# EAGLE design control (EAGLE 5.01)
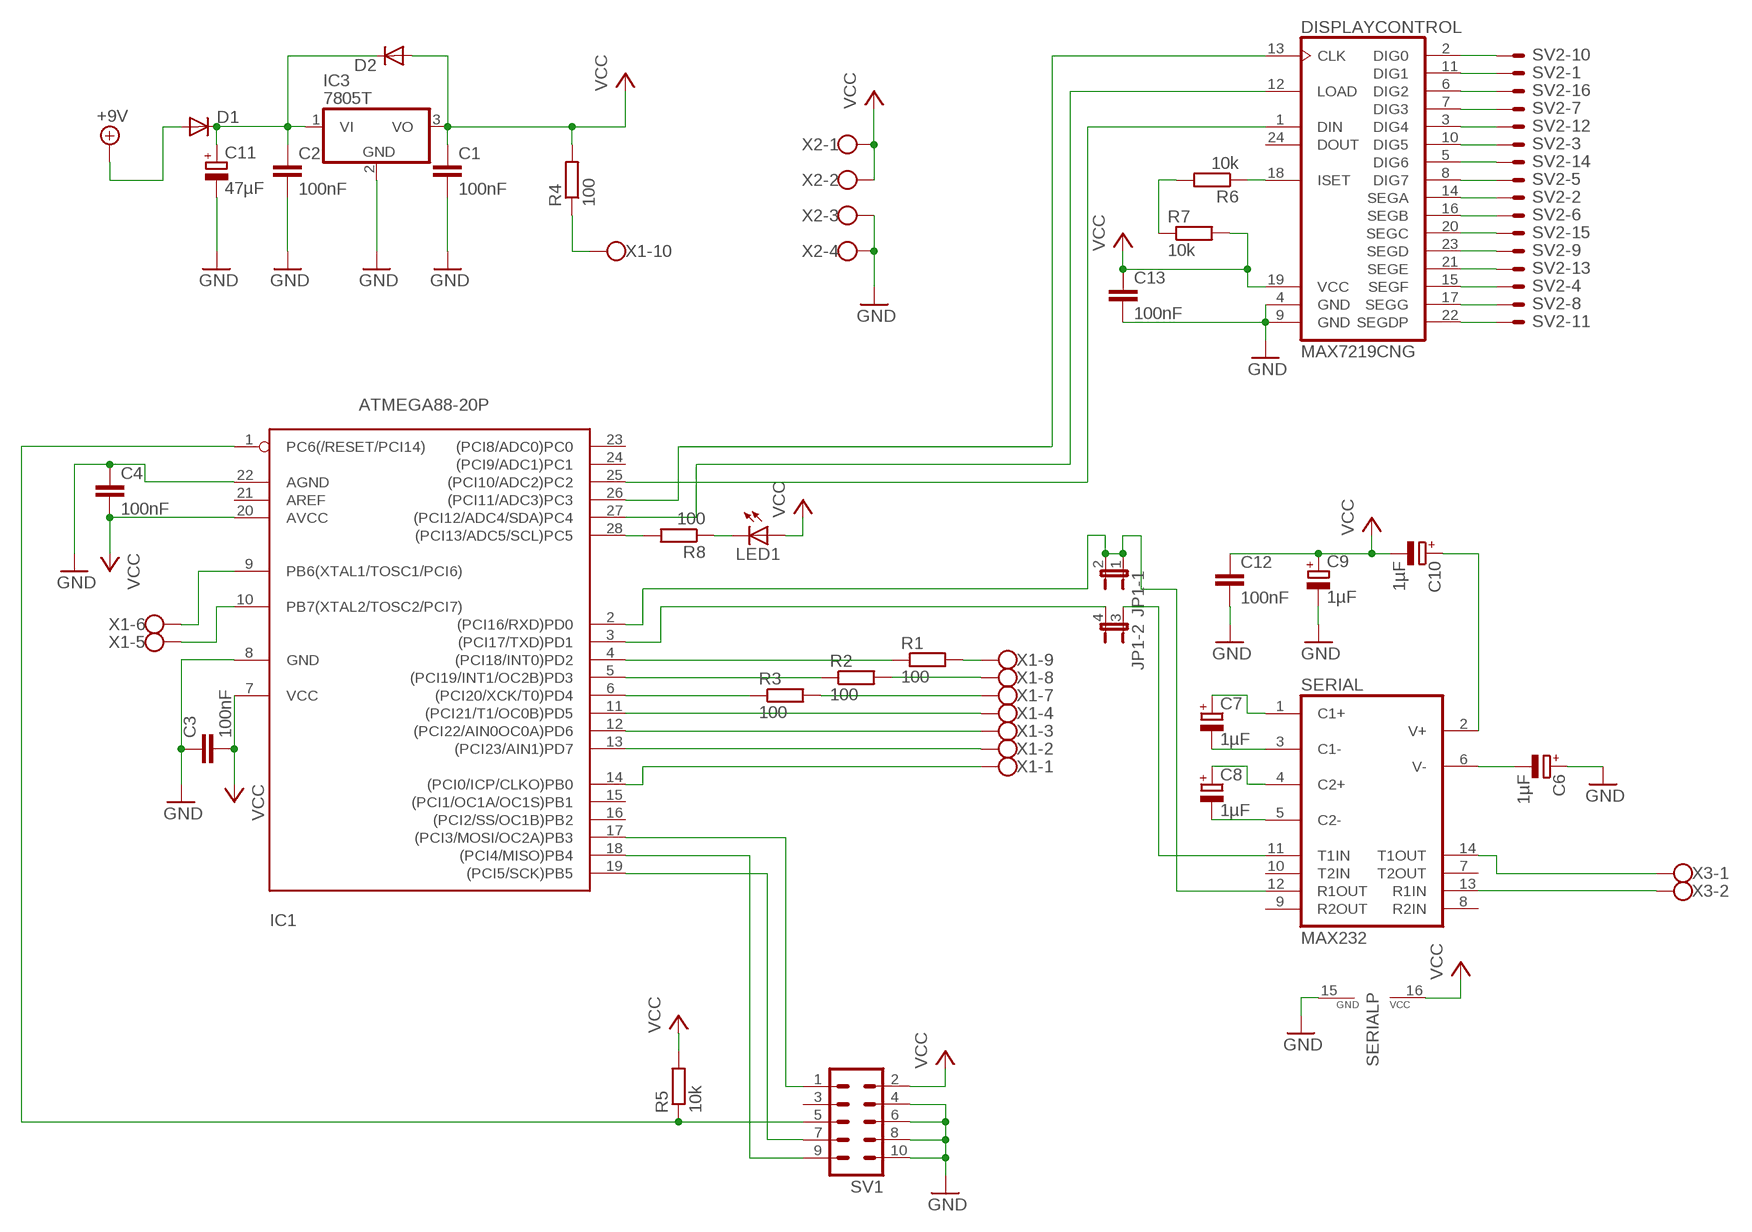
[diagram p0: schematic, sheet 1]

## Parts
C1  100nF  C-EU025-024X044  [C025-024X044]
C2  100nF  C-EU025-024X044  [C025-024X044]
C3  100nF  C-EU025-024X044  [C025-024X044]
C4  100nF  C-EU025-024X044  [C025-024X044]
C6  1µF  CPOL-EUE22-6AXIAL  [E22-6]
C7  1µF  CPOL-EUE22-6AXIAL  [E22-6]
C8  1µF  CPOL-EUE22-6AXIAL  [E22-6]
C9  1µF  CPOL-EUE22-6AXIAL  [E22-6]
C10  1µF  CPOL-EUE22-6AXIAL  [E22-6]
C11  47µF  CPOL-EUE2,5-6E  [E2,5-6E]
C12  100nF  C-EU025-024X044  [C025-024X044]
C13  100nF  C-EU025-024X044  [C025-024X044]
D1  DIODE-C1702-05  [C1702-05]
D2  DIODE-C1702-05  [C1702-05]
DISPLAYCONTROL  MAX7219CNG  [DIL24-3]
IC1  ATMEGA88-20P  [DIL28-3]
IC3  7805T  [TO220H]
JP1  JP2QE  [JP2Q]
LED1  LED3MM  [LED3MM]
R1  100  R-EU_0204/5  [0204/5]
R2  100  R-EU_0204/5  [0204/5]
R3  100  R-EU_0204/5  [0204/5]
R4  100  R-EU_0204/5  [0204/5]
R5  10k  R-EU_0204/5  [0204/5]
R6  10k  R-EU_0309/V  [0309V]
R7  10k  R-EU_0309/V  [0309V]
R8  100  R-EU_0204/5  [0204/5]
SERIAL  MAX232  [DIL16]
SV1  ML10  [ML10]
SV2  ML16E  [ML16]
X1  W237-10P  [W237-10P]
X2  W237-04P  [W237-4P]
X3  W237-02P  [W237-132]

## Nets
+9V: D1.A
CLOCK: DISPLAYCONTROL.13(CLK) IC1.26((PCI11/ADC3)PC3)
DIN: DISPLAYCONTROL.1(DIN) IC1.25((PCI10/ADC2)PC2)
GND: C1.2 C2.2 C3.1 C4.1 C6.+ C9.- C11.- C12.2 C13.2 DISPLAYCONTROL.4(GND) DISPLAYCONTROL.9(GND) IC1.8(GND) IC1.22(AGND) IC3.2(GND) SERIAL.15(GND) SV1.4 SV1.6 SV1.8 SV1.10 X2.3 X2.4
ISP_MISO: IC1.18((PCI4/MISO)PB4) SV1.9
ISP_MOSI: IC1.17((PCI3/MOSI/OC2A)PB3) SV1.1
ISP_RESET: IC1.1(PC6(/RESET/PCI14)) R5.1 SV1.5
ISP_SCK: IC1.19((PCI5/SCK)PB5) SV1.7
LOAD: DISPLAYCONTROL.12(LOAD) IC1.27((PCI12/ADC4/SDA)PC4)
N$1: IC1.3((PCI17/TXD)PD1) JP1.4
N$3: IC1.4((PCI18/INT0)PD2) R1.1
N$4: C7.+ SERIAL.1(C1+)
N$6: C7.- SERIAL.3(C1-)
N$7: IC1.5((PCI19/INT1/OC2B)PD3) R2.1
N$8: DISPLAYCONTROL.18(ISET) R6.1
N$9: C8.+ SERIAL.4(C2+)
N$10: C8.- SERIAL.5(C2-)
N$11: C10.+ SERIAL.2(V+)
N$12: IC1.6((PCI20/XCK/T0)PD4) R3.1
N$13: R1.2 X1.9
N$14: R2.2 X1.8
N$15: R3.2 X1.7
N$16: IC1.14((PCI0/ICP/CLKO)PB0) X1.1
N$17: SERIAL.13(R1IN) X3.2
N$18: C2.1 C11.+ D1.C D2.C IC3.1(VI)
N$19: IC1.10(PB7(XTAL2/TOSC2/PCI7)) X1.5
N$20: IC1.9(PB6(XTAL1/TOSC1/PCI6)) X1.6
N$21: DISPLAYCONTROL.20(SEGC) SV2.15
N$22: IC1.12((PCI22/AIN0OC0A)PD6) X1.3
N$23: R4.1 X1.10
N$24: SERIAL.14(T1OUT) X3.1
N$25: DISPLAYCONTROL.11(DIG1) SV2.1
N$26: DISPLAYCONTROL.6(DIG2) SV2.16
N$27: DISPLAYCONTROL.7(DIG3) SV2.7
N$28: DISPLAYCONTROL.21(SEGE) SV2.13
N$29: DISPLAYCONTROL.10(DIG5) SV2.3
N$30: DISPLAYCONTROL.5(DIG6) SV2.14
N$31: DISPLAYCONTROL.8(DIG7) SV2.5
N$32: DISPLAYCONTROL.14(SEGA) SV2.2
N$33: DISPLAYCONTROL.16(SEGB) SV2.6
N$34: DISPLAYCONTROL.3(DIG4) SV2.12
N$35: DISPLAYCONTROL.23(SEGD) SV2.9
N$36: DISPLAYCONTROL.22(SEGDP) SV2.11
N$37: DISPLAYCONTROL.17(SEGG) SV2.8
N$38: DISPLAYCONTROL.2(DIG0) SV2.10
N$40: C6.- SERIAL.6(V-)
N$41: R6.2 R7.1
N$42: IC1.13((PCI23/AIN1)PD7) X1.2
N$43: IC1.11((PCI21/T1/OC0B)PD5) X1.4
N$48: IC1.28((PCI13/ADC5/SCL)PC5) R8.2
N$58: LED1.K(C) R8.1
N$59: IC1.2((PCI16/RXD)PD0) JP1.1 JP1.2 SERIAL.12(R1OUT)
N$60: JP1.3 SERIAL.11(T1IN)
SEGF: DISPLAYCONTROL.15(SEGF) SV2.4
VCC: C1.1 C3.2 C4.2 C9.+ C10.- C12.1 C13.1 D2.A DISPLAYCONTROL.19(VCC) IC1.7(VCC) IC1.20(AVCC) IC3.3(VO) LED1.A R4.2 R5.2 R7.2 SERIAL.16(VCC) SV1.2 X2.1 X2.2
Unconnected: DISPLAYCONTROL.24(DOUT) IC1.15((PCI1/OC1A/OC1S)PB1) IC1.16((PCI2/SS/OC1B)PB2) IC1.21(AREF) IC1.23((PCI8/ADC0)PC0) IC1.24((PCI9/ADC1)PC1) SERIAL.7(T2OUT) SERIAL.8(R2IN) SERIAL.9(R2OUT) SERIAL.10(T2IN) SV1.3

## Library data of the parts
C1-C4 C12 C13 = rcl:C-EU: CAPACITOR, European symbol
C6-C11 = rcl:CPOL-EU: POLARIZED CAPACITOR, European symbol
D1 D2 = diode:DIODE-: DIODE
DISPLAYCONTROL = maxim:MAX7219CNG: LED DISPLAY DRIVER
IC1 = avr:ATMEGA88*P: MICROCONTROLLER 8 kBytes FLASH 1 kBytes SRAM 512 Bytes EEPROM USART 8-channel 10 bit ADC
IC3 = linear:78*: Positive VOLTAGE REGULATOR Source: http://cache.national.com/ds/LM/LM78L05.pdf http://www.fairchildsemi.com/ds/LM/LM7805.pdf
JP1 = jumper:JP2QE: JUMPER
LED1 = led:LED: LED OSRAM: - CHIPLED LG R971, LG N971, LY N971, LG Q971, LY Q971, LO R971, LY R971 LH N974, LH R974 LS Q976, LO Q976, LY Q976 LO Q996 - Hyper CHIPLED LW Q18S LB Q993, LB Q99A, LB R99A - SideLED LS A670, LO A670, LY A670, LG A670, LP A670 LB A673, LV A673, LT A673, LW A673 LH A674 LY A675 LS A676, LA A676, LO A676, LY A676, LW A676 LS A679, LY A679, LG A679 - Hyper Micro SIDELED® LS Y876, LA Y876, LO Y876, LY Y876 LT Y87S - SmartLED LW L88C, LW L88S LB L89C, LB L89S, LG L890 LS L89K, LO L89K, LY L89K LS L896, LA L896, LO L896, LY L896 - TOPLED LS T670, LO T670, LY T670, LG T670, LP T670 LSG T670, LSP T670, LSY T670, LOP T670, LYG T670 LG T671, LOG T671, LSG T671 LB T673, LV T673, LT T673, LW T673 LH T674 LS T676, LA T676, LO T676, LY T676, LB T676, LH T676, LSB T676, LW T676 LB T67C, LV T67C, LT T67C, LS T67K, LO T67K, LY T67K, LW E67C LS E67B, LA E67B, LO E67B, LY E67B, LB E67C, LV E67C, LT E67C LW T67C LS T679, LY T679, LG T679 LS T770, LO T770, LY T770, LG T770, LP T770 LB T773, LV T773, LT T773, LW T773 LH T774 LS E675, LA E675, LY E675, LS T675 LS T776, LA T776, LO T776, LY T776, LB T776 LHGB T686 LT T68C, LB T68C - Hyper Mini TOPLED® LB M676 - Mini TOPLED Santana® LG M470 LS M47K, LO M47K, LY M47K Source: http://www.osram.convergy.de - LUMILED® LXK2-PW12-R00, LXK2-PW12-S00, LXK2-PW14-U00, LXK2-PW14-V00 LXK2-PM12-R00, LXK2-PM12-S00, LXK2-PM14-U00 LXK2-PE12-Q00, LXK2-PE12-R00, LXK2-PE12-S00, LXK2-PE14-T00, LXK2-PE14-U00 LXK2-PB12-K00, LXK2-PB12-L00, LXK2-PB12-M00, LXK2-PB14-N00, LXK2-PB14-P00, LXK2-PB14-Q00 LXK2-PR12-L00, LXK2-PR12-M00, LXK2-PR14-Q00, LXK2-PR14-R00 LXK2-PD12-Q00, LXK2-PD12-R00, LXK2-PD12-S00 LXK2-PH12-R00, LXK2-PH12-S00 LXK2-PL12-P00, LXK2-PL12-Q00, LXK2-PL12-R00 Source: www.luxeon.com
R1-R5 R8 = resistor:R-EU_: RESISTOR, European symbol
R6 R7 = rcl:R-EU_: RESISTOR, European symbol
SERIAL = maxim:MAX232: RS232 TRANSEIVER
SV1 = con-harting-ml:ML10: HARTING
SV2 = con-harting-ml:ML16?E: HARTING
X1 = con-wago-508:W237-10P: WAGO SREW CLAMP
X2 = con-wago-508:W237-04P: WAGO SREW CLAMP
X3 = con-wago-508:W237-02P: WAGO SREW CLAMP

## Board
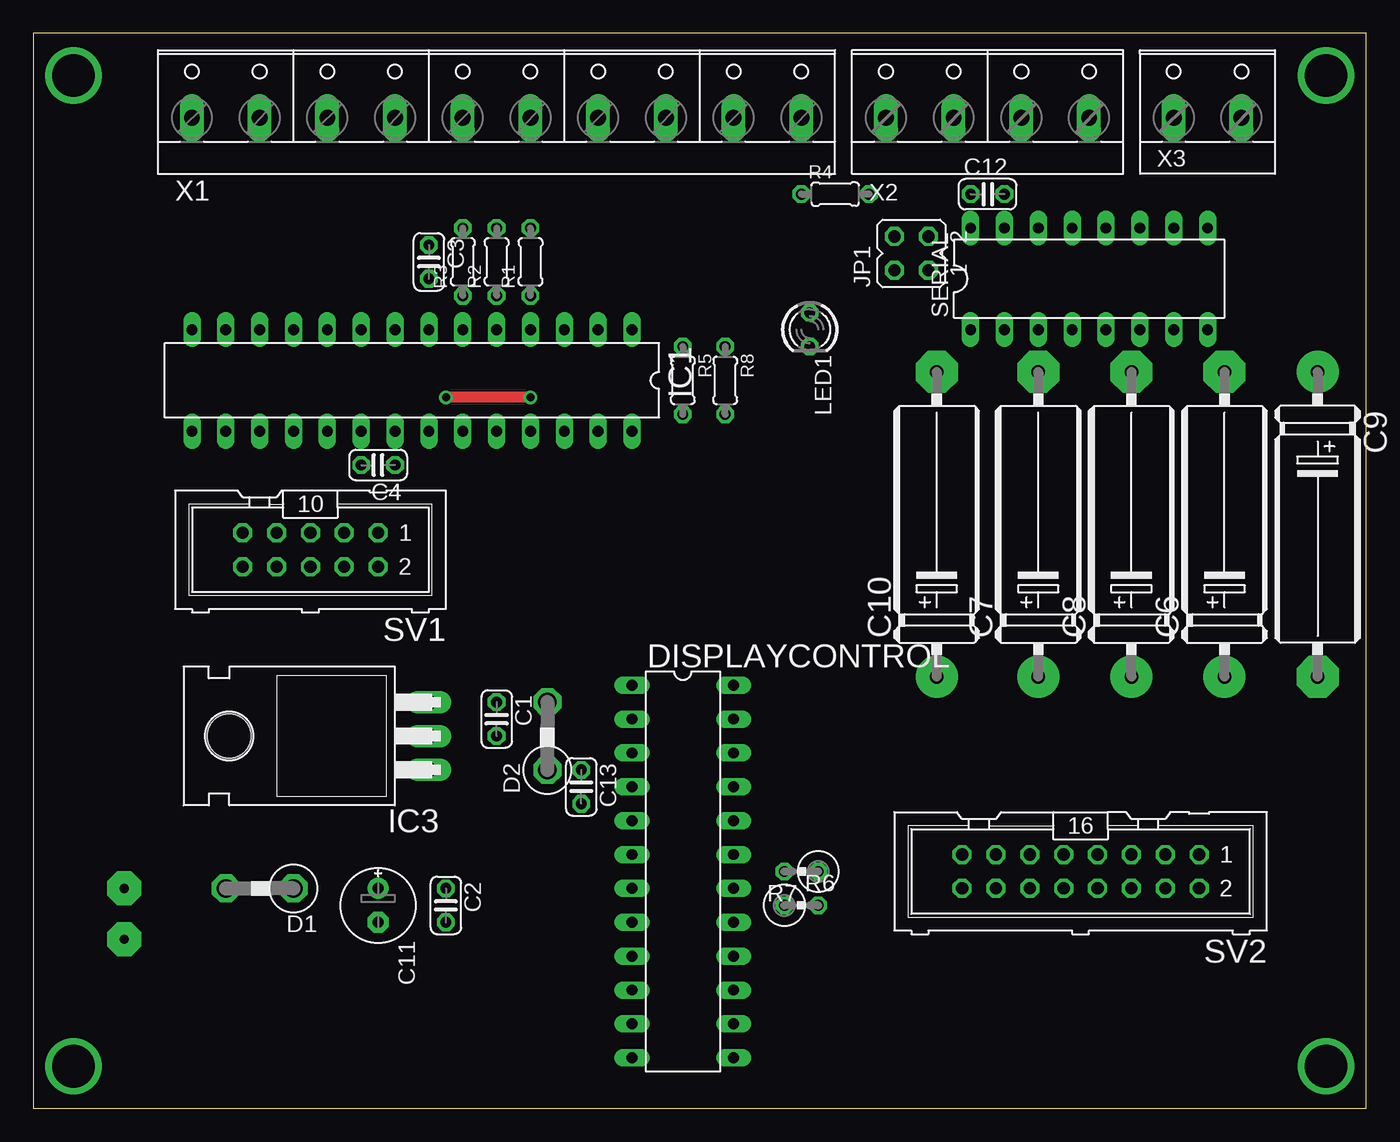
[diagram p1: board, top side]
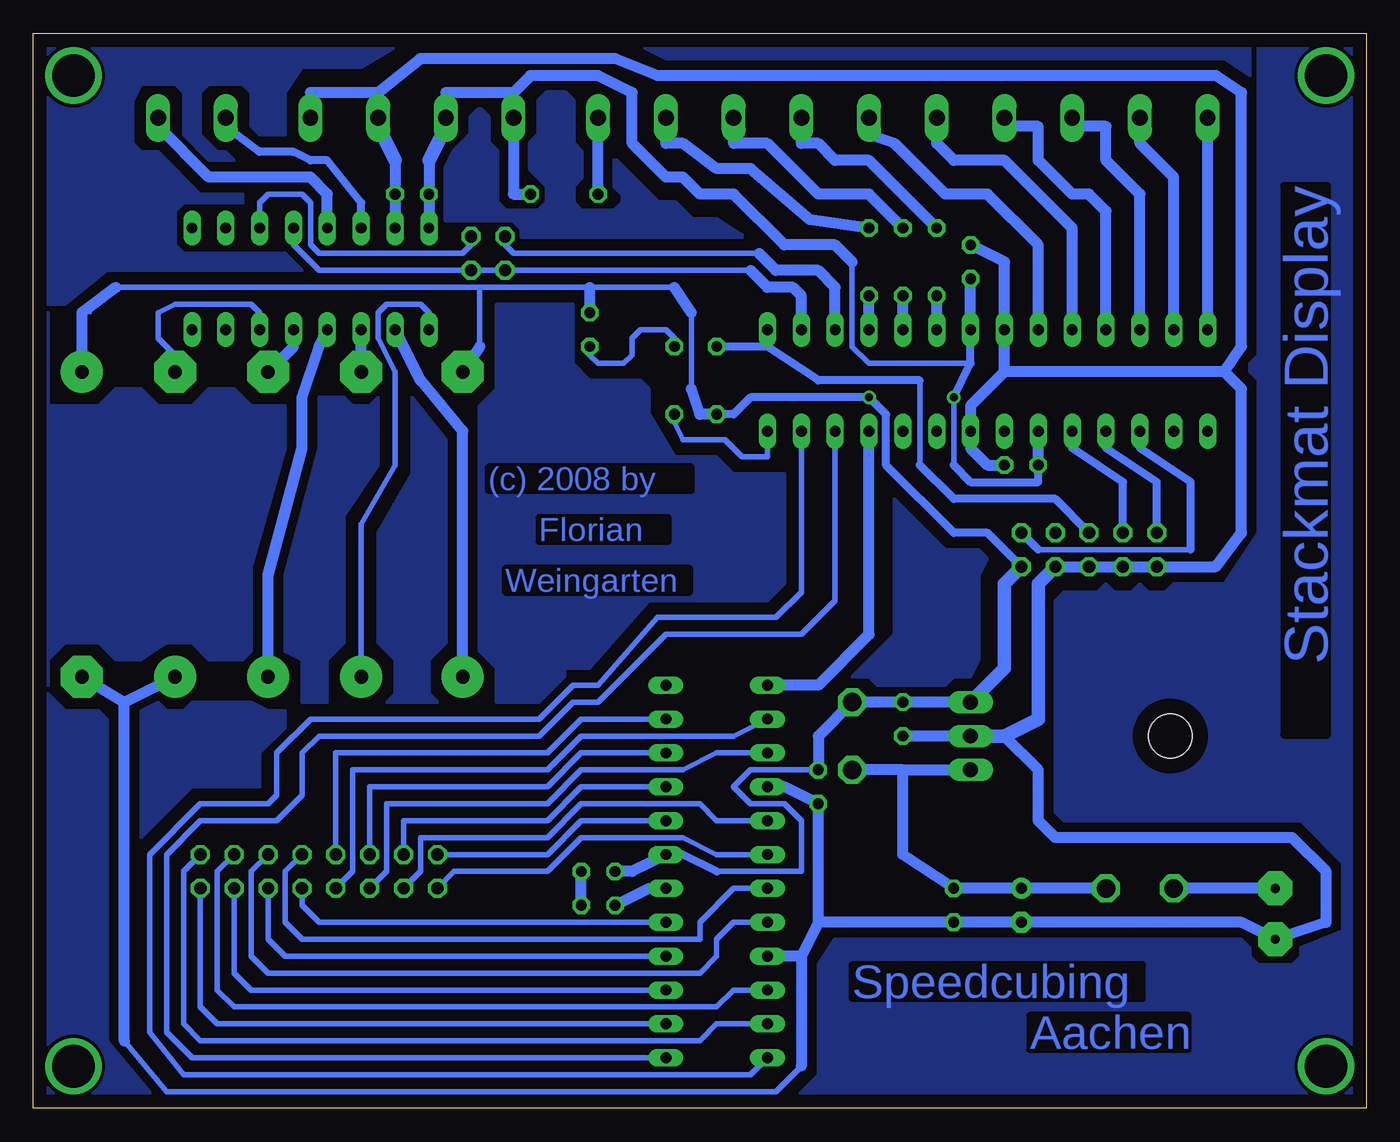
[diagram p2: board, bottom side, seen from below]

Size 100 x 80.64 mm. Coordinates in mm from the lower left corner, seen from the top.
Outline: 0,0 100,0 100,80.64 0,80.64 0,0
Copper layers (1*16): Top 0.035mm / dielectric 1.5mm / Bottom 0.035mm
Design rules "default": minimum track width 10mil, minimum drill 24mil, track to track 8mil, track to pad 8mil, pad to pad 8mil, via to via 8mil, smd to smd 8mil, copper to edge 40mil, drill to drill 8mil, minimum pad ring 10mil, minimum via ring 8mil, stop-mask expansion 4mil, vias tented up to drill 0mil, thermal gap 10mil

### Footprints (pad centres in the part's own frame; a part is rotated, then mirrored left to right if it is on the bottom)
C025-024X044 = drill 0.813 octagon: 1 -1.27,0; 2 1.27,0
E22-6 = drill 1.016 pad 3.15 round: + -11.43,0 | drill 1.016 pad 3.15 octagon: - 11.43,0
E2,5-6E = drill 0.813 pad 1.575 round: + -1.27,0 | drill 0.813 pad 1.575 octagon: - 1.27,0
C1702-05 = drill 1.397 octagon: A 2.54,0; C -2.54,0
DIL24-3 = drill 0.813 long: 1 -13.97,-3.81; 2 -11.43,-3.81; 3 -8.89,-3.81; 4 -6.35,-3.81; 5 -3.81,-3.81; 6 -1.27,-3.81; 7 1.27,-3.81; 8 3.81,-3.81; 9 6.35,-3.81; 10 8.89,-3.81; 11 11.43,-3.81; 12 13.97,-3.81; 13 13.97,3.81; 14 11.43,3.81; 15 8.89,3.81; 16 6.35,3.81; 17 3.81,3.81; 18 1.27,3.81; 19 -1.27,3.81; 20 -3.81,3.81; 21 -6.35,3.81; 22 -8.89,3.81; 23 -11.43,3.81; 24 -13.97,3.81
DIL28-3 = drill 0.813 long: 1 -16.51,-3.81; 2 -13.97,-3.81; 3 -11.43,-3.81; 4 -8.89,-3.81; 5 -6.35,-3.81; 6 -3.81,-3.81; 7 -1.27,-3.81; 8 1.27,-3.81; 9 3.81,-3.81; 10 6.35,-3.81; 11 8.89,-3.81; 12 11.43,-3.81; 13 13.97,-3.81; 14 16.51,-3.81; 15 16.51,3.81; 16 13.97,3.81; 17 11.43,3.81; 18 8.89,3.81; 19 6.35,3.81; 20 3.81,3.81; 21 1.27,3.81; 22 -1.27,3.81; 23 -3.81,3.81; 24 -6.35,3.81; 25 -8.89,3.81; 26 -11.43,3.81; 27 -13.97,3.81; 28 -16.51,3.81
TO220H = drill 1.118 long: 1 -2.54,-10.16; 2 0,-10.16; 3 2.54,-10.16 | hole 3.302: 0,4.826
JP2Q = drill 0.914 octagon: 1 -1.27,-1.27; 2 -1.27,1.27; 3 1.27,-1.27; 4 1.27,1.27
LED3MM = drill 0.813 octagon: A -1.27,0; K 1.27,0
0204/5 = drill 0.813 octagon: 1 -2.54,0; 2 2.54,0
0309V = drill 0.813 octagon: 1 -1.27,0; 2 1.27,0
DIL16 = drill 0.813 long: 1 -8.89,-3.81; 2 -6.35,-3.81; 3 -3.81,-3.81; 4 -1.27,-3.81; 5 1.27,-3.81; 6 3.81,-3.81; 7 6.35,-3.81; 8 8.89,-3.81; 9 8.89,3.81; 10 6.35,3.81; 11 3.81,3.81; 12 1.27,3.81; 13 -1.27,3.81; 14 -3.81,3.81; 15 -6.35,3.81; 16 -8.89,3.81
ML10 = drill 0.914 octagon: 1 -5.08,-1.27; 2 -5.08,1.27; 3 -2.54,-1.27; 4 -2.54,1.27; 5 0,-1.27; 6 0,1.27; 7 2.54,-1.27; 8 2.54,1.27; 9 5.08,-1.27; 10 5.08,1.27
ML16 = drill 0.914 octagon: 1 -8.89,-1.27; 2 -8.89,1.27; 3 -6.35,-1.27; 4 -6.35,1.27; 5 -3.81,-1.27; 6 -3.81,1.27; 7 -1.27,-1.27; 8 -1.27,1.27; 9 1.27,-1.27; 10 1.27,1.27; 11 3.81,-1.27; 12 3.81,1.27; 13 6.35,-1.27; 14 6.35,1.27; 15 8.89,-1.27; 16 8.89,1.27
W237-10P = drill 1.194 long: 1 -22.86,-0.635; 2 -17.78,-0.635; 3 -12.7,-0.635; 4 -7.62,-0.635; 5 -2.54,-0.635; 6 2.54,-0.635; 7 7.62,-0.635; 8 12.7,-0.635; 9 17.78,-0.635; 10 22.86,-0.635
W237-4P = drill 1.194 long: 1 -7.62,-0.635; 2 -2.54,-0.635; 3 2.54,-0.635; 4 7.62,-0.635
W237-132 = drill 1.194 long: 1 -2.54,-0.635; 2 2.54,-0.635

### Placement (x,y rotation side)
C1  34.76,29.21 270 top
C2  30.95,15.24 270 top
C3  29.68,63.49 270 top
C4  25.87,48.26 180 top
C6  89.37,43.81 90 top
C7  75.4,43.81 90 top
C8  82.38,43.81 90 top
C9  96.35,43.81 270 top
C10  67.78,43.81 90 top
C11  25.87,15.24 270 top
C12  71.59,68.58 0 top
C13  41.11,24.12 270 top
D1  16.98,16.5 180 top
D2  38.57,27.94 90 top
DISPLAYCONTROL  48.73,17.78 270 top
IC1  28.41,54.61 180 top
IC3  19.52,27.94 90 top
JP1  65.88,64.13 90 top
LED1  58.26,58.41 270 top
R1  37.3,63.49 90 top
R2  34.76,63.49 90 top
R3  32.22,63.49 90 top
R4  60.16,68.58 0 top
R5  48.73,54.61 270 top
R6  57.62,15.24 0 top
R7  57.62,17.78 180 top
R8  51.91,54.61 270 top
SERIAL  79.21,62.23 0 top
SV1  20.79,41.91 180 top
SV2  78.57,17.78 180 top
X1  34.76,74.92 0 top
X2  71.59,74.92 0 top
X3  88.1,74.92 0 top

### Tracks (layer width: path | path; a pad name or v marks a point on that pad's centre or on a via)
+9V  (via drill 0.7 pad 2.54)
  Bottom 0.813: v6.82,16.5 D1.A
CLOCK
  Bottom 0.406: DISPLAYCONTROL.13 88.1,3.8 90,5.71 90,19.05 87.46,21.59 81.75,21.59 79.84,23.49 79.84,26.66 78.57,27.94 62.07,27.94 59.52,30.48 57.62,30.48 52.54,35.55 42.38,35.55 39.84,38.09 IC1.26 39.84,51.43
DIN
  Bottom 0.813: IC1.25 37.3,35.55 41.11,31.75 DISPLAYCONTROL.1
GND  (via drill 0.7 pad 2.54)
  Bottom 0.406: 42.38,3.17 44.29,1.26 90,1.26 93.18,5.08
  Bottom 0.813: 27.14,27.94 24.6,25.39 24.6,21.59 23.33,20.32 5.55,20.32 3.01,17.78 3.01,13.96 v6.82,12.7 9.36,13.96 C11.- C2.2 41.11,13.96 | IC3.2 C1.2 | C3.1 27.14,63.49 IC1.8 27.14,55.24 | C4.1 28.41,48.26 29.68,49.52 IC1.22 29.68,52.7 27.14,55.24 | SV1.4 SV1.6 SV1.8 SV1.10 11.27,40.63 9.36,43.17 9.36,53.97 10.63,55.24 | 74.13,76.2 X2.3 74.13,73.66 | 74.13,76.2 79.21,76.2 X2.4 79.21,73.66 | SERIAL.15 C12.2 72.86,71.11 | 41.11,13.96 42.38,11.43 | 42.38,11.43 DISPLAYCONTROL.9 | DISPLAYCONTROL.4 43.65,24.12 C13.2 41.11,13.96 | 42.38,11.43 42.38,3.17 | 93.18,5.08 93.18,30.48 | 93.18,30.48 C6.+ | 93.18,30.48 C9.- | 10.63,55.24 27.14,55.24 | 10.63,55.24 9.36,57.15 9.36,76.2 11.27,77.47 53.18,77.47 56.35,78.73 70.95,78.73 74.13,76.2
  Bottom 1.016: SV1.4 24.6,39.37 24.6,29.21 27.14,27.94 IC3.2 | 74.13,73.66 72.86,71.11
ISP_MISO
  Bottom 0.61: IC1.18 19.52,49.52 15.71,46.98 SV1.9
ISP_MOSI
  Bottom 0.406: 13.17,41.91 24.6,41.91
  Bottom 0.61: IC1.17 16.98,49.52 13.17,46.98 13.17,41.91 | 24.6,41.91 SV1.1
ISP_RESET
  Bottom 0.406: 33.49,48.26 33.49,54.61
  Bottom 0.61: SV1.5 23.33,45.72 30.95,45.72 33.49,48.26 | 33.49,54.61 41.11,54.61 44.92,57.15 | 44.92,57.15 IC1.1 | 44.92,57.15 R5.1
ISP_SCK
  Bottom 0.61: IC1.19 22.06,49.52 18.25,46.98 SV1.7
LOAD
  Bottom 0.406: IC1.27 42.38,38.73 44.29,36.83 53.18,36.83 57.62,31.75 59.52,31.75 62.07,29.21 79.21,29.21 81.75,26.66 81.75,23.49 82.38,22.86 87.46,22.86 91.27,19.05 91.27,5.71 88.73,2.54 46.19,2.54 DISPLAYCONTROL.12
N$1
  Bottom 0.406: JP1.4 64.61,64.77 63.97,64.13 45.55,64.13
  Bottom 0.813: 45.55,64.13 44.29,62.86 41.11,62.86 39.84,61.59 IC1.3
N$3
  Bottom 0.813: IC1.4 R1.1
N$4
  Bottom 0.406: SERIAL.1 70.32,59.69 70.95,60.32 73.49,60.32 74.13,59.69 74.13,57.78 72.86,55.24 72.86,48.26 75.4,43.81 C7.+
N$5
  pour Bottom (isolate 0.254): -0.17,80.64 8.09,80.64 8.09,56.51 8.72,55.88 8.72,55.24 8.09,54.61 8.09,43.17 10.63,39.37 14.44,39.37 15.08,38.73 16.34,38.73 16.98,39.37 17.61,38.73 18.88,38.73 19.52,39.37 20.15,38.73 22.69,38.73 23.33,38.09 23.33,22.22 22.69,21.59 4.92,21.59 1.74,18.41 1.74,13.33 4.92,12.06 4.92,11.43 5.55,10.79 8.09,10.79 8.72,11.43 8.72,12.06 9.36,12.7 39.84,12.7 41.11,10.79 41.11,2.54 43.02,0.63 -0.17,0.63
N$6
  Bottom 0.813: C7.- SERIAL.3
N$7
  Bottom 0.813: IC1.5 R2.1
N$8
  Bottom 0.813: DISPLAYCONTROL.18 53.81,16.5 R6.1
N$9
  Bottom 0.813: SERIAL.4 78.57,57.15 79.84,53.34 79.84,49.52 82.38,40 C8.+
N$10
  Bottom 0.813: C8.- 80.48,57.15 SERIAL.5
N$11
  Bottom 0.813: SERIAL.2 70.95,54.61 67.78,50.8 C10.+
N$12
  Bottom 0.813: IC1.6 R3.1
N$13
  Bottom 0.813: R1.2 41.75,66.67 46.19,70.48 48.73,70.48 51.27,72.39 52.54,72.39 X1.9 52.54,74.92
N$14
  Bottom 0.813: R2.2 37.3,68.58 41.11,68.58 44.92,72.39 47.46,72.39 X1.8 47.46,74.92
N$15
  Bottom 0.813: R3.2 37.3,71.11 39.84,71.11 41.11,72.39 42.38,72.39 X1.7 42.38,74.92
N$16
  Bottom 0.813: IC1.14 X1.1 11.9,74.92
N$17
  Bottom 0.813: SERIAL.13 77.94,68.58 79.21,69.84 86.83,69.84 90.64,73.66 X3.2 90.64,74.92
N$18
  Bottom 0.813: D1.C C11.+ C2.1 34.76,19.05 34.76,25.39 | 34.76,25.39 IC3.1 | 34.76,25.39 D2.C
N$19
  Bottom 0.813: IC1.10 22.06,66.03 27.14,71.11 30.95,71.11 32.22,72.39 X1.5 32.22,74.92
N$20
  Bottom 0.813: IC1.9 24.6,64.77 28.41,68.58 31.58,68.58 35.4,72.39 37.3,73.02 X1.6 37.3,74.92
N$21
  Bottom 0.406: DISPLAYCONTROL.20 58.89,21.59 61.43,19.05 SV2.15
N$22
  Bottom 0.813: 22.06,74.92 X1.3 22.06,73.66 19.52,73.66 19.52,71.11 16.98,68.58 IC1.12
N$23
  Bottom 0.813: R4.1 X1.10 57.62,74.92
N$24
  Bottom 0.61: 85.56,73.66 83.02,71.75 80.48,71.75 79.21,71.11 77.94,71.11 75.4,67.94 SERIAL.14
  Bottom 1.016: 85.56,73.66 X3.1 85.56,74.92
N$25
  Bottom 0.406: DISPLAYCONTROL.11 48.73,6.34 50,5.08 87.46,5.08 88.73,6.34 88.73,17.78 SV2.1
N$26
  Bottom 0.406: DISPLAYCONTROL.6 48.73,19.05 51.27,20.32 58.89,20.32 61.43,17.78 68.41,17.78 SV2.16
N$27
  Bottom 0.406: DISPLAYCONTROL.7 47.46,16.5 50,13.96 50,12.7 79.84,12.7 81.11,13.96 81.11,17.78 SV2.7
N$28
  Bottom 0.406: DISPLAYCONTROL.21 58.89,24.12 61.43,21.59 72.22,21.59 SV2.13
N$29
  Bottom 0.406: DISPLAYCONTROL.10 47.46,8.88 48.73,7.61 84.92,7.61 86.19,8.88 86.19,17.78 SV2.3
N$30
  Bottom 0.406: DISPLAYCONTROL.5 48.73,21.59 50,22.86 58.89,22.86 61.43,20.32 70.95,20.32 70.95,17.78 SV2.14
N$31
  Bottom 0.406: DISPLAYCONTROL.8 47.46,13.96 48.73,12.7 48.73,11.43 50,10.16 82.38,10.16 83.66,11.43 83.66,17.78 SV2.5
N$32
  Bottom 0.406: DISPLAYCONTROL.14 86.19,6.34 87.46,7.61 SV2.2
N$33
  Bottom 0.406: DISPLAYCONTROL.16 81.11,11.43 82.38,12.7 SV2.6
N$34
  Bottom 0.406: SV2.12 73.49,17.78 73.49,22.86 61.43,22.86 58.89,25.39 51.27,25.39 48.73,26.66 DISPLAYCONTROL.3
N$35
  Bottom 0.406: DISPLAYCONTROL.23 58.89,29.21 61.43,26.66 77.3,26.66 SV2.9
N$36
  Bottom 0.406: DISPLAYCONTROL.22 58.89,26.66 61.43,24.12 74.77,24.12 SV2.11
N$37
  Bottom 0.406: DISPLAYCONTROL.17 78.57,13.96 79.84,15.24 SV2.8
N$38
  Bottom 0.406: DISPLAYCONTROL.2 47.46,27.94 58.89,27.94 61.43,25.39 76.03,25.39 76.03,17.78 SV2.10
N$40
  Bottom 0.406: SERIAL.6 83.02,59.69 83.66,60.32 89.37,60.32 90.64,59.69 90.64,57.78 89.37,56.51 C6.-
N$41
  Bottom 0.813: R6.2 R7.1
N$42
  Bottom 0.813: 16.98,74.92 X1.2 16.98,72.39 14.44,69.84 IC1.13
N$43
  Bottom 0.813: 27.14,74.92 X1.4 27.14,73.66 24.6,73.66 24.6,71.11 22.06,68.58 20.79,68.58 19.52,67.31 IC1.11
N$44  (via drill 3.2 pad 3.81)
  other vias: 3.01,3.17
N$45  (via drill 3.2 pad 3.81)
  other vias: 3.01,77.47
N$46  (via drill 3.2 pad 3.81)
  other vias: 96.99,3.17
N$47  (via drill 3.2 pad 3.81)
  other vias: 96.99,77.47
N$48
  Bottom 0.406: IC1.28 44.92,48.89 46.83,48.89 48.09,50.16 51.27,50.16 51.91,51.43 R8.2
N$49
  pour Bottom (isolate 0.254): 43.65,47.62 47.46,47.62 48.73,48.89 51.91,48.89 53.81,52.06 53.81,53.97 54.45,54.61 58.26,54.61 59.52,55.88 59.52,60.32 65.24,60.32 65.24,53.97 66.51,52.7 66.51,34.29 65.24,33.02 65.24,30.48 62.07,30.48 60.16,32.38 60.16,33.02 58.26,33.02 53.81,38.09 44.92,38.09 43.65,39.37
N$50
  pour Bottom (isolate 0.254): 28.41,41.27 29.04,41.91 31.58,41.91 35.4,45.72 35.4,35.55 38.57,32.38 37.3,32.38 36.66,31.75 31.58,31.75 30.95,32.38 29.68,32.38 29.04,33.65 29.04,40
N$51
  pour Bottom (isolate 0.254): 8.72,77.47 10.63,78.73 52.54,78.73 55.08,80 72.22,80 75.4,78.1 79.84,78.1 81.11,76.2 81.11,73.02 83.02,73.02 83.66,73.66 83.66,76.2 84.29,76.83 86.83,76.83 87.46,76.2 87.46,73.02 86.19,71.75 85.56,71.75 84.92,71.11 86.83,71.11 88.73,73.02 88.73,76.2 89.37,76.83 91.91,76.83 92.55,75.56 92.55,72.39 91.91,71.75 90.64,71.75 87.46,68.58 84.29,68.58 84.29,67.94 88.73,67.94 89.37,67.31 89.37,64.77 88.73,64.13 81.11,64.13 79.84,62.86 94.45,62.86 97.62,60.32 99.53,60.32 99.53,80.64 8.72,80.64
N$52
  pour Bottom: 46.83,65.4 48.73,66.67 50.64,66.67 51.91,67.94 53.18,67.94 56.35,71.11 56.35,69.21 55.72,68.58 55.72,67.94 56.35,67.31 58.89,67.31 59.52,67.94 59.52,69.21 58.89,69.84 58.89,71.75 59.52,72.39 59.52,75.56 60.16,76.2 61.43,76.2 62.07,75.56 62.07,73.02 62.7,72.39 62.7,70.48 61.43,69.21 61.43,67.94 62.07,67.31 64.61,67.31 65.24,67.94 65.24,71.75 65.88,72.39 65.88,74.29 66.51,74.92 67.14,74.29 67.14,73.02 68.41,71.75 69.05,70.48 69.05,66.67 63.97,66.67 63.34,66.03 63.34,65.4
N$53
  pour Bottom (isolate 0.254): 71.59,53.34 69.05,50.16 69.05,34.92 70.32,33.65 70.32,31.11 69.68,30.48 73.49,30.48 72.86,31.11 72.86,33.65 74.13,34.92 74.13,43.17 71.59,47.62
N$54
  pour Bottom (isolate 0.254): 74.13,53.34 74.13,48.26 76.67,44.45 76.67,34.92 77.94,33.65 77.94,30.48 79.84,30.48 79.84,33.65 81.11,34.29 81.11,40 78.57,49.52 78.57,53.34 76.67,53.34 76.03,52.7 74.77,52.7
N$55
  pour Bottom (isolate 0.254): 94.45,29.21 95.08,29.84 97.62,29.84 98.89,31.11 100.16,31.11 100.16,0.63 91.27,0.63 91.27,1.26 94.45,5.08
N$56
  pour Bottom (isolate 0.254): 91.91,20.32 91.91,29.84 90.64,30.48 90,29.84 88.73,29.84 88.1,30.48 83.66,30.48 82.38,29.84 81.11,29.84 81.11,28.57 83.02,26.66 83.02,24.12 88.1,24.12
N$57
  pour Bottom (isolate 0.254): 81.11,52.7 83.66,52.7 84.92,53.97 86.83,53.97 88.1,52.7 90.64,52.7 91.91,53.97 93.81,53.97 95.08,52.7 98.89,52.7 98.89,59.69 100.16,59.69 100.16,31.75 98.89,31.75 98.89,33.65 97.62,34.92 95.08,34.92 93.81,33.65 91.91,33.65 90,34.92 88.1,34.92 86.83,33.65 84.29,33.65 83.66,34.29 83.66,40.63 81.11,49.52
N$58
  Bottom 0.406: R8.1 51.91,57.78 52.54,58.41 54.45,58.41 55.08,57.78 55.08,56.51 55.72,55.88 57.62,55.88 58.26,56.51 LED1.K
N$59
  Bottom 0.406: 46.19,62.86 JP1.2 JP1.1 78.57,62.86 80.48,64.77 SERIAL.12
  Bottom 0.813: IC1.2 42.38,60.95 43.02,61.59 44.92,61.59 46.19,62.86
N$60
  Bottom 0.406: SERIAL.11 83.02,67.94 82.38,68.58 79.84,68.58 79.21,67.94 79.21,64.77 78.57,64.13 67.78,64.13 67.14,64.77 JP1.3
SEGF
  Bottom 0.406: DISPLAYCONTROL.15 83.66,8.88 84.92,10.16 SV2.4
VCC  (via drill 0.6)
  Top 0.813: v37.3,53.34 v30.95,53.34
  Bottom 0.254: 95.95,59.99 95.72,59.69
  Bottom 0.406: C13.1 46.19,25.39 47.46,24.12 46.19,22.86 43.65,22.86 42.38,21.59 42.38,17.78 48.73,17.78 | 29.68,55.88 37.3,55.88 38.57,57.15 38.57,63.49 | 51.91,61.59 58.26,61.59 66.51,61.59 | 66.51,61.59 93.81,61.59 | 66.51,61.59 66.51,57.15 | v30.95,53.34 30.95,48.26 | 50.64,53.97 50.64,59.69
  Bottom 0.61: C4.2 24.6,46.98 29.68,46.98 30.95,48.26 | v30.95,53.34 29.68,55.88 IC1.7 | R5.2 47.46,52.06 46.19,53.34 v37.3,53.34 36.03,52.06 36.03,48.26 30.95,43.17 28.41,43.17 SV1.2 | 48.73,17.78 51.27,19.05 DISPLAYCONTROL.19
  Bottom 0.813: IC1.7 C3.2 | C4.2 IC1.20 | 30.95,30.48 C1.1 D2.A 41.11,27.94 C13.1 | X2.1 63.97,73.66 | 63.97,76.2 69.05,76.2 X2.2 69.05,73.66 | 63.97,76.2 62.7,77.47 57.62,77.47 55.08,76.2 55.08,72.39 52.54,69.84 51.27,69.84 50,68.58 47.46,68.58 43.65,64.77 39.84,64.77 38.57,63.49 | R4.2 63.97,68.58 X2.1 | 63.97,76.2 X2.1 | 66.51,57.15 C10.- | SERIAL.16 C12.1 70.32,71.11 | R7.2 55.08,17.78 DISPLAYCONTROL.19 | R5.2 50,52.06 50.64,53.97 | 50.64,59.69 51.91,61.59 | 58.26,61.59 LED1.A | 93.81,61.59 95.95,59.99 96.35,59.69 C9.+
  Bottom 1.016: SV1.2 27.14,39.37 27.14,33.02 IC3.3 30.95,30.48 | 69.05,73.66 70.32,71.11

### Text on the board
Bottom: Stackmat Display | (c) 2008 by | Florian | Weingarten | Speedcubing | Aachen